# Altium schematic sheet Block_Diagram.SchDoc
size A4; SheetNumber: 1; SheetTotal: 8
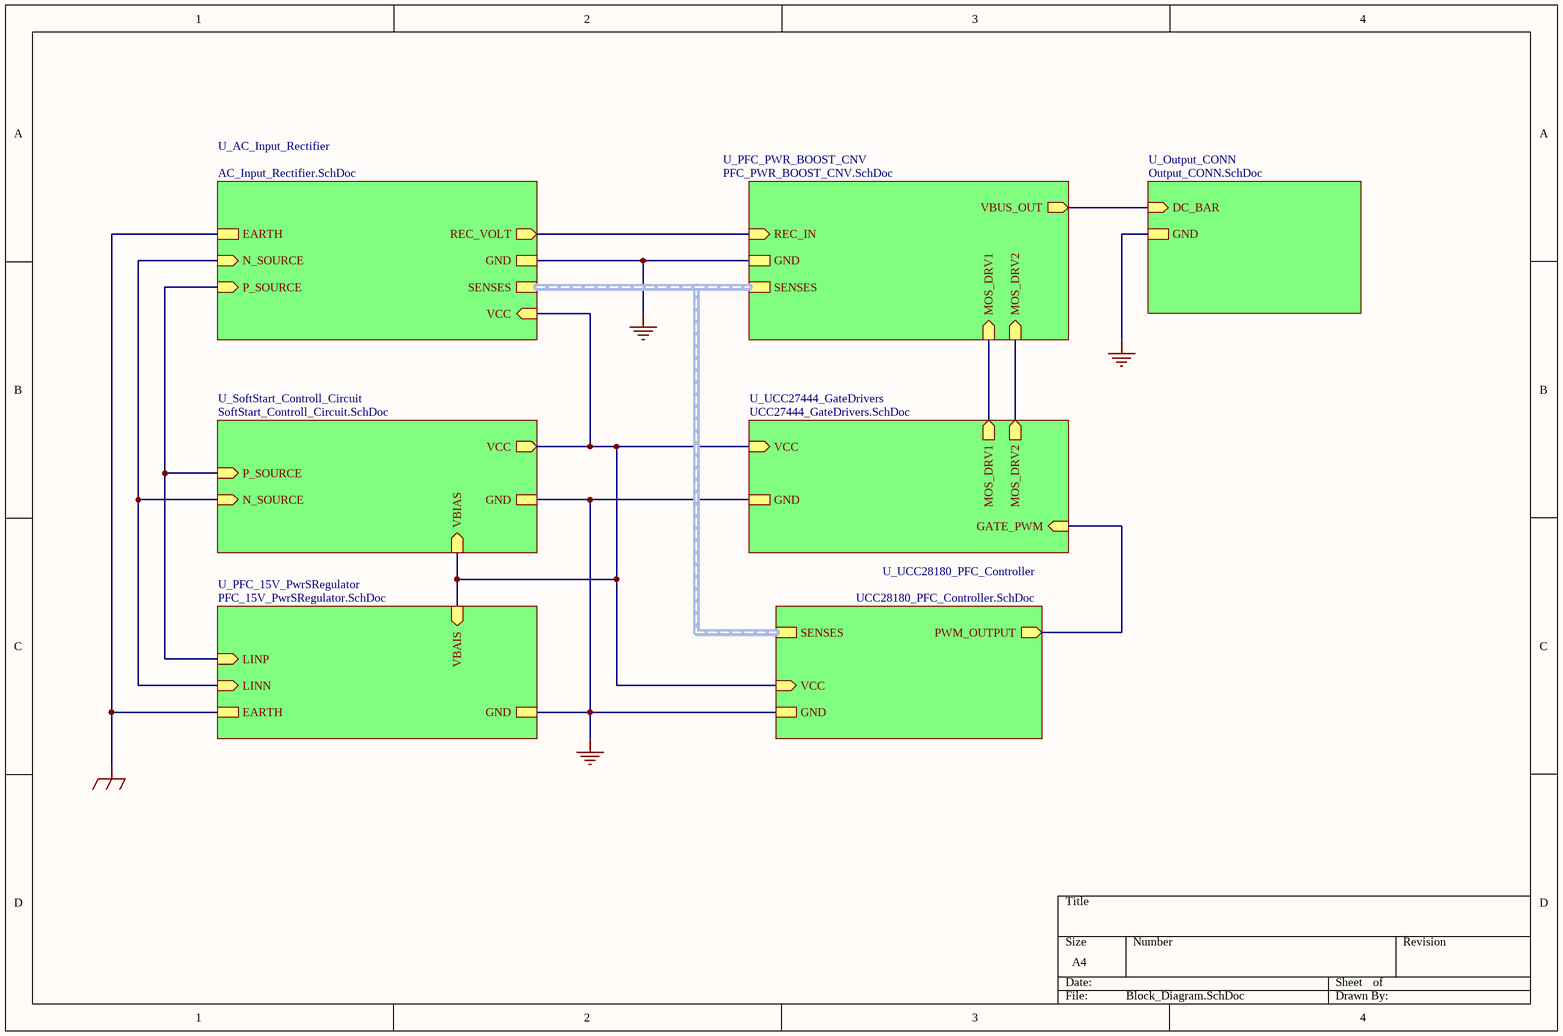
[diagram p0: Block_Diagram.SchDoc]

## Sub-sheets
U_AC_Input_Rectifier = AC_Input_Rectifier.SchDoc: REC_VOLT (out), VCC (in), P_SOURCE (in), N_SOURCE (in), GND, SENSES (harness SENSES), EARTH
U_Output_CONN = Output_CONN.SchDoc: DC_BAR (in), GND
U_PFC_15V_PwrSRegulator = PFC_15V_PwrSRegulator.SchDoc: LINP (in), LINN (in), VBAIS (in), GND, EARTH
U_PFC_PWR_BOOST_CNV = PFC_PWR_BOOST_CNV.SchDoc: VBUS_OUT (out), GND, MOS_DRV1 (in), MOS_DRV2 (in), REC_IN (in), SENSES (harness SENSES)
U_SoftStart_Controll_Circuit = SoftStart_Controll_Circuit.SchDoc: GND, P_SOURCE (in), N_SOURCE (in), VBIAS (in), VCC (out)
U_UCC27444_GateDrivers = UCC27444_GateDrivers.SchDoc: MOS_DRV1 (out), MOS_DRV2 (out), VCC (in), GND, GATE_PWM (in)
U_UCC28180_PFC_Controller = UCC28180_PFC_Controller.SchDoc: VCC (in), GND, SENSES (harness SENSES), PWM_OUTPUT (out)

## Nets
EARTH: sheet U_AC_Input_Rectifier/EARTH, sheet U_PFC_15V_PwrSRegulator/EARTH
GND: sheet U_AC_Input_Rectifier/GND, sheet U_PFC_PWR_BOOST_CNV/GND, sheet U_UCC27444_GateDrivers/GND, sheet U_UCC28180_PFC_Controller/GND, sheet U_SoftStart_Controll_Circuit/GND, sheet U_Output_CONN/GND, sheet U_PFC_15V_PwrSRegulator/GND
(unnamed): sheet U_AC_Input_Rectifier/REC_VOLT, sheet U_PFC_PWR_BOOST_CNV/REC_IN
(unnamed): sheet U_AC_Input_Rectifier/VCC, sheet U_UCC27444_GateDrivers/VCC, sheet U_UCC28180_PFC_Controller/VCC, sheet U_SoftStart_Controll_Circuit/VBIAS, sheet U_SoftStart_Controll_Circuit/VCC, sheet U_PFC_15V_PwrSRegulator/VBAIS
(unnamed): sheet U_AC_Input_Rectifier/P_SOURCE, sheet U_SoftStart_Controll_Circuit/P_SOURCE, sheet U_PFC_15V_PwrSRegulator/LINP
(unnamed): sheet U_AC_Input_Rectifier/N_SOURCE, sheet U_SoftStart_Controll_Circuit/N_SOURCE, sheet U_PFC_15V_PwrSRegulator/LINN
(unnamed): sheet U_PFC_PWR_BOOST_CNV/VBUS_OUT, sheet U_Output_CONN/DC_BAR
(unnamed): sheet U_PFC_PWR_BOOST_CNV/MOS_DRV1, sheet U_UCC27444_GateDrivers/MOS_DRV1
(unnamed): sheet U_PFC_PWR_BOOST_CNV/MOS_DRV2, sheet U_UCC27444_GateDrivers/MOS_DRV2
(unnamed): sheet U_UCC27444_GateDrivers/GATE_PWM, sheet U_UCC28180_PFC_Controller/PWM_OUTPUT

## Buses and harness runs
harness sheet U_AC_Input_Rectifier/SENSES = sheet U_PFC_PWR_BOOST_CNV/SENSES = sheet U_UCC28180_PFC_Controller/SENSES